# EAGLE design BTsoundCard Proto R1 (EAGLE 9.6.2)
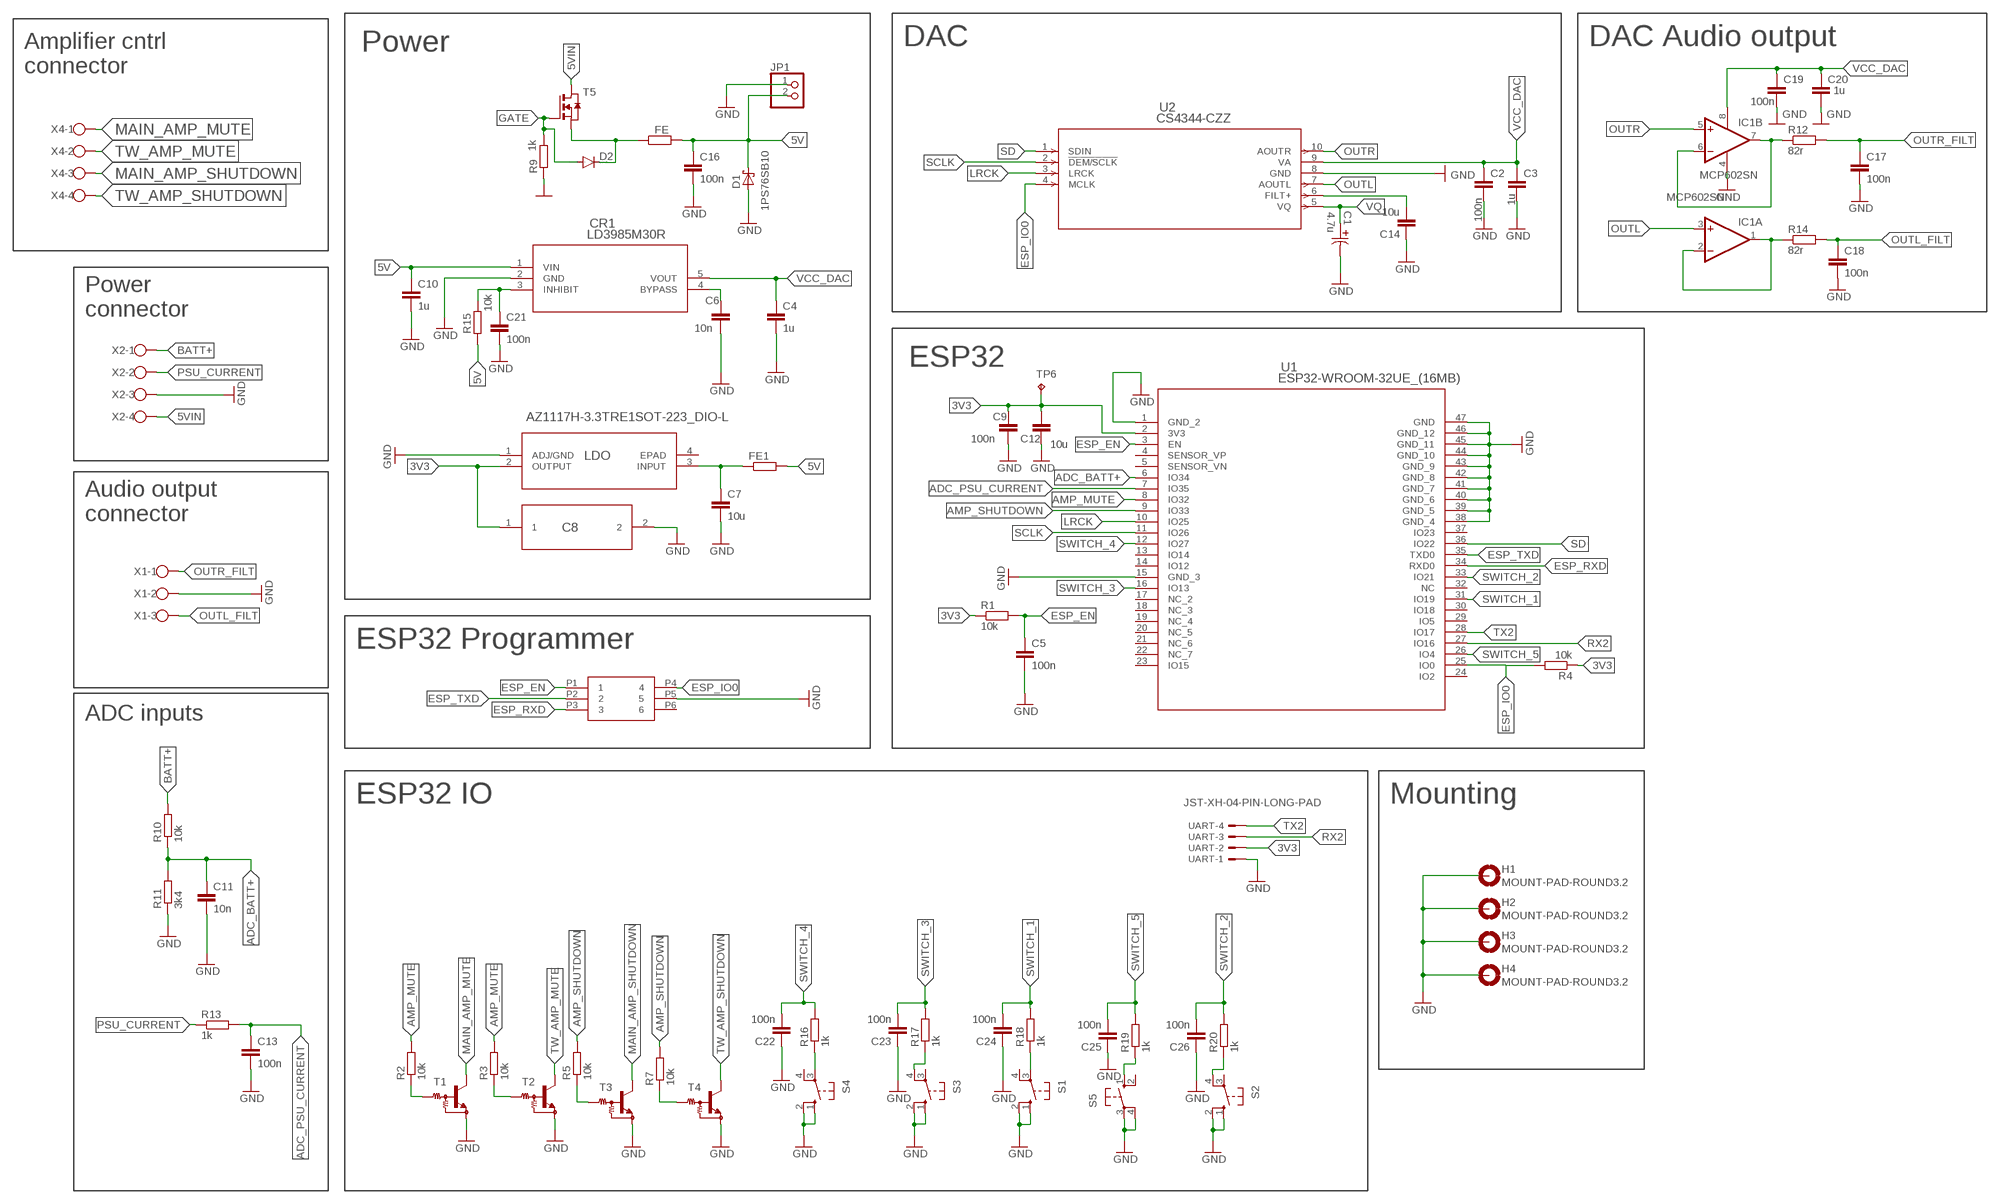
[diagram p0: schematic, sheet 1]

## Parts
C1  4.7u  EEEFK1H4R7RCAP_EEFK_B_PAN-M  [CAP_EEFK_B_PAN-M]
C2  100n  C-EUC0603  [C0603]
C3  1u  C-EUC0603  [C0603]
C4  1u  C-EUC0603  [C0603]
C5  100n  C-EUC0603  [C0603]
C6  10n  C-EUC0603  [C0603]
C7  10u  C-EUC0805  [C0805]
C8  TPSC336K010R0375  [TPSC336K010R0375_AVX]
C9  100n  C-EUC0603  [C0603]
C10  1u  C-EUC0603  [C0603]
C11  10n  C-EUC0603  [C0603]
C12  10u  C-EUC0805  [C0805]
C13  100n  C-EUC0603  [C0603]
C14  10u  C-EUC0805  [C0805]
C16  100n  C-EUC0603  [C0603]
C17  100n  C-EUC0603  [C0603]
C18  100n  C-EUC0603  [C0603]
C19  100n  C-EUC0603  [C0603]
C20  1u  C-EUC0603  [C0603]
C21  100n  C-EUC0603  [C0603]
C22  100n  C-EUC0603  [C0603]
C23  100n  C-EUC0603  [C0603]
C24  100n  C-EUC0603  [C0603]
C25  100n  C-EUC0603  [C0603]
C26  100n  C-EUC0603  [C0603]
CR1  LD3985M30R  [SOT23-5L_STM]
D1  1PS76SB10  [SOD323(F)]
D2  5.1V  DIODE-MINIMELF  [MINIMELF]
FE  R-EU_R0805  [R0805]
FE1  R-EU_R0805  [R0805]
H1  MOUNT-PAD-ROUND3.2  [3,2-PAD]
H2  MOUNT-PAD-ROUND3.2  [3,2-PAD]
H3  MOUNT-PAD-ROUND3.2  [3,2-PAD]
H4  MOUNT-PAD-ROUND3.2  [3,2-PAD]
IC1  MCP602SN  [SO08]
JP1  PINHD-1X2  [1X02]
LDO  AZ1117H-3.3TRE1SOT-223_DIO-L  [SOT-223_DIO-L]
R1  10k  R-EU_R0603  [R0603]
R2  10k  R-EU_R0603  [R0603]
R3  10k  R-EU_R0603  [R0603]
R4  10k  R-EU_R0603  [R0603]
R5  10k  R-EU_R0603  [R0603]
R7  10k  R-EU_R0603  [R0603]
R9  1k  R-EU_R1206  [R1206]
R10  10k  R-EU_R0805  [R0805]
R11  3k4  R-EU_R0603  [R0603]
R12  82r  R-EU_R1206  [R1206]
R13  1k  R-EU_R0603  [R0603]
R14  82r  R-EU_R1206  [R1206]
R15  10k  R-EU_R0603  [R0603]
R16  1k  R-EU_R0603  [R0603]
R17  1k  R-EU_R0603  [R0603]
R18  1k  R-EU_R0603  [R0603]
R19  1k  R-EU_R0603  [R0603]
R20  1k  R-EU_R0603  [R0603]
S1  10-XX  [B3F-10XX]
S2  10-XX  [B3F-10XX]
S3  10-XX  [B3F-10XX]
S4  10-XX  [B3F-10XX]
S5  10-XX  [B3F-10XX]
T1  MUN2212T1-NPN_DRIVER-SC59-BEC  [SC59-BEC]
T2  MUN2212T1-NPN_DRIVER-SC59-BEC  [SC59-BEC]
T3  MUN2212T1-NPN_DRIVER-SC59-BEC  [SC59-BEC]
T4  MUN2212T1-NPN_DRIVER-SC59-BEC  [SC59-BEC]
T5  NMOSSOT23  [SOT-23]
TP6  TPPAD1-13  [P1-13]
U1  ESP32-WROOM-32UE_(16MB)  [IC38_ESP32-WROOM-32UE_(16MB)_E]
U2  CS4344-CZZ  [CIR-TSSOP-10]
U$3  3X2  [2X3]
UART  JST-XH-04-PIN-LONG-PAD  [JST-XH-04-PACKAGE-LONG-PAD]
X1  W237-103  [W237-103]
X2  W237-4  [W237-4]
X4  W237-4  [W237-4]

## Nets
3V3: C8.1 C9.1 C12.2 LDO.2(OUTPUT) R1.1 R4.1 TP6.TP U1.2(3V3) UART.2
5V: C10.1 C16.1 CR1.1(VIN) D1.1(K) FE1.2 FE.2 JP1.2 R15.1
5VIN: T5.1(D) X2.4
ADC_BATT+: C11.1 R10.1 R11.2 U1.6(IO34)
ADC_PSU_CURRENT: C13.1 R13.2 U1.7(IO35)
AMP_MUTE: R2.2 R3.2 U1.8(IO32)
AMP_SHUTDOWN: R5.2 R7.2 U1.9(IO33)
BATT+: R10.2 X2.1
ESP_EN: C5.1 R1.2 U1.3(EN) U$3.P1
ESP_IO0: R4.2 U1.25(IO0) U2.4(MCLK) U$3.P4
ESP_RXD: U1.34(RXD0) U$3.P3
ESP_TXD: U1.35(TXD0) U$3.P2
GATE: D2.A R9.2 T5.3(G)
GND: C1.2 C2.2 C3.2 C4.2 C5.2 C6.2 C7.2 C8.2 C9.2 C10.2 C11.2 C12.1 C13.2 C14.1 C16.2 C17.2 C18.2 C19.2 C20.2 C21.2 C22.1 C23.1 C24.1 C25.1 C26.1 CR1.2(GND) D1.2(A) H1.B3,2(MOUNT) H2.B3,2(MOUNT) H3.B3,2(MOUNT) H4.B3,2(MOUNT) IC1.4(P:V-) JP1.1 LDO.1(ADJ/GND) R9.1 R11.1 S1.1(S) S1.2(S1) S2.1(S) S2.2(S1) S3.1(S) S3.2(S1) S4.1(S) S4.2(S1) S5.3(P) S5.4(P1) T1.E T2.E T3.E T4.E U1.1(GND_2) U1.15(GND_3) U1.38(GND_4) U1.39(GND_5) U1.40(GND_6) U1.41(GND_7) U1.42(GND_8) U1.43(GND_9) U1.44(GND_10) U1.45(GND_11) U1.46(GND_12) U1.47(GND) U2.8(GND) U$3.P5 UART.1 X1.2 X2.3
LRCK: U1.10(IO25) U2.3(LRCK)
MAIN_AMP_MUTE: T1.C X4.1
MAIN_AMP_SHUTDOWN: T3.C X4.3
N$2: IC1.6(B:-IN) IC1.7(B:OUT) R12.1
N$4: R16.1 S4.3(P)
N$5: C6.1 CR1.4(BYPASS)
N$6: R17.1 S3.4(P1)
N$7: C14.2 U2.6(FILT+)
N$8: C7.1 FE1.1 LDO.3(INPUT)
N$9: R2.1 T1.B
N$10: R3.1 T2.B
N$11: R5.1 T3.B
N$12: R7.1 T4.B
N$13: R18.1 S1.3(P)
N$14: C21.1 CR1.3(INHIBIT) R15.2
N$15: R19.1 S5.1(S)
N$16: R20.1 S2.4(P1)
N$17: D2.C FE.1 T5.2(S)
N$20: IC1.1(A:OUT) IC1.2(A:-IN) R14.1
OUTL: IC1.3(A:+IN) U2.7(AOUTL)
OUTL_FILT: C18.1 R14.2 X1.3
OUTR: IC1.5(B:+IN) U2.10(AOUTR)
OUTR_FILT: C17.1 R12.2 X1.1
PSU_CURRENT: R13.1 X2.2
RX2: U1.27(IO16) UART.3
SCLK: U1.11(IO26) U2.2(!DEM/SCLK)
SD: U1.36(IO22) U2.1(SDIN)
SWITCH_1: C24.2 R18.2 U1.31(IO19)
SWITCH_2: C26.2 R20.2 U1.33(IO21)
SWITCH_3: C23.2 R17.2 U1.16(IO13)
SWITCH_4: C22.2 R16.2 U1.12(IO27)
SWITCH_5: C25.2 R19.2 U1.26(IO4)
TW_AMP_MUTE: T2.C X4.2
TW_AMP_SHUTDOWN: T4.C X4.4
TX2: U1.28(IO17) UART.4
VCC_DAC: C2.1 C3.1 C4.1 C19.1 C20.1 CR1.5(VOUT) IC1.8(P:V+) U2.9(VA)
VQ: C1.1 U2.5(VQ)
Unconnected: LDO.4(EPAD) S1.4(P1) S2.3(P) S3.3(P) S4.4(P1) S5.2(S1) U1.4(SENSOR_VP) U1.5(SENSOR_VN) U1.13(IO14) U1.14(IO12) U1.17(NC_2) U1.18(NC_3) U1.19(NC_4) U1.20(NC_5) U1.21(NC_6) U1.22(NC_7) U1.23(IO15) U1.24(IO2) U1.29(IO5) U1.30(IO18) U1.32(NC) U1.37(IO23) U$3.P6

## Notes on the sheet
- Power | DAC | DAC Audio output
- Amplifier cntrl
  connector
- Power
  connector
- ESP32
- Audio output
  connector
- ESP32 Programmer
- ADC inputs
- ESP32 IO | Mounting

## Library data of the parts
C1 = Panasonic EEEFK1H4R7R:EEEFK1H4R7R; BUILT_BY: EMA_UL_Team; MANUFACTURER_PART_NUMBER: EEEFK1H4R7R; SOURCELIBRARY: Panasonic_2012-04-02a; VENDOR: Panasonic
C2-C7 C9-C14 C16-C26 = rcl:C-EU: CAPACITOR, European symbol; SPICEPREFIX: C
C8 = TPSC336K010R0375:TPSC336K010R0375; BUILT_BY: EMA_Colton; COPYRIGHT: Copyright (C) 2018 Accelerated Designs. All rights reserved; DATASHEET: https://datasheets.avx.com/TPS.pdf; MANUFACTURER_PART_NUMBER: TPSC336K010R0375; SOURCELIBRARY: Add_to_database_2021-03-22; VENDOR: AVX Corporation
CR1 = LD3985:LD3985M30R; COPYRIGHT: Copyright (C) 2023 Ultra Librarian. All rights reserved.; MANUFACTURER_PART_NUMBER: LD3985M30R; MFR_NAME: STMicroelectronics
D1 = SOD-123:1PS76SB10: Schottky barrier diode Planar Schottky barrier diode encapsulated in a SOD323 very small plastic SMD package. AAL Eindhoven MK
D2 = diode:DIODE-: DIODE
FE FE1 R1-R5 R7 R9-R20 = rcl:R-EU_: RESISTOR, European symbol; SPICEPREFIX: R
H1-H4 = holes:MOUNT-PAD-ROUND: MOUNTING PAD, round
IC1 = linear:MCP602: Single Op Amp 2.7V to 6.0V Single Supply CMOS Source: http://ww1.microchip.com/downloads/en/DeviceDoc/21314g.pdf
JP1 = pinhead:PINHD-1X2: PIN HEADER
LDO = sot223 3.3v 1A:AZ1117H-3.3TRE1; BUILT_BY: EMA_UL_Team; MANUFACTURER_PART_NUMBER: AZ1117H-3.3TRE1; SOURCELIBRARY: DIODESINC_2_2015-08-18; VENDOR: Diodes Inc
S1-S5 = switch-omron:10-XX: OMRON SWITCH; MPN: B3F-1000; OC_FARNELL: 176432; OC_NEWARK: 36M3542
T1-T4 = transistor:*-NPN_DRIVER-: NPN Bias Resistor Transistor
T5 = zetex:NMOSSOT23: MOS FET; OC_FARNELL: unknown; OC_NEWARK: unknown
TP6 = testpad:TP: Test pad
U1 = ESP32-WROOM-32:ESP32-WROOM-32UE_(16MB); COPYRIGHT: Copyright (C) 2022 Ultra Librarian. All rights reserved.; MANUFACTURER_PART_NUMBER: ESP32-WROOM-32UE (16MB); MFR_NAME: Espressif Systems
U2 = user:CS4344-CZZ; COPYRIGHT: Copyright (C) 2023 Ultra Librarian. All rights reserved.; MANUFACTURER_PART_NUMBER: CS4344-CZZ; MFR_NAME: Cirrus Logic
U$3 = IDC_3x2:3X2
UART = JST XH Connectors v1-0:JST-XH-04-PIN: JST XH Connector 2 Pin Wire to board connector. Pitch: 2,54 mm, (0.100") Number of pins: 4 Created by Rembrandt Electronics www.rembrandtelectronics.com
X1 = con-wago-500:W237-103: WAGO SCREW CLAMP; MPN: 237-103; OC_FARNELL: unknown; OC_NEWARK: 18M7116
X2 X4 = con-wago-500:W237-4: WAGO SCREW CLAMP; OC_FARNELL: unknown; OC_NEWARK: unknown

## Board
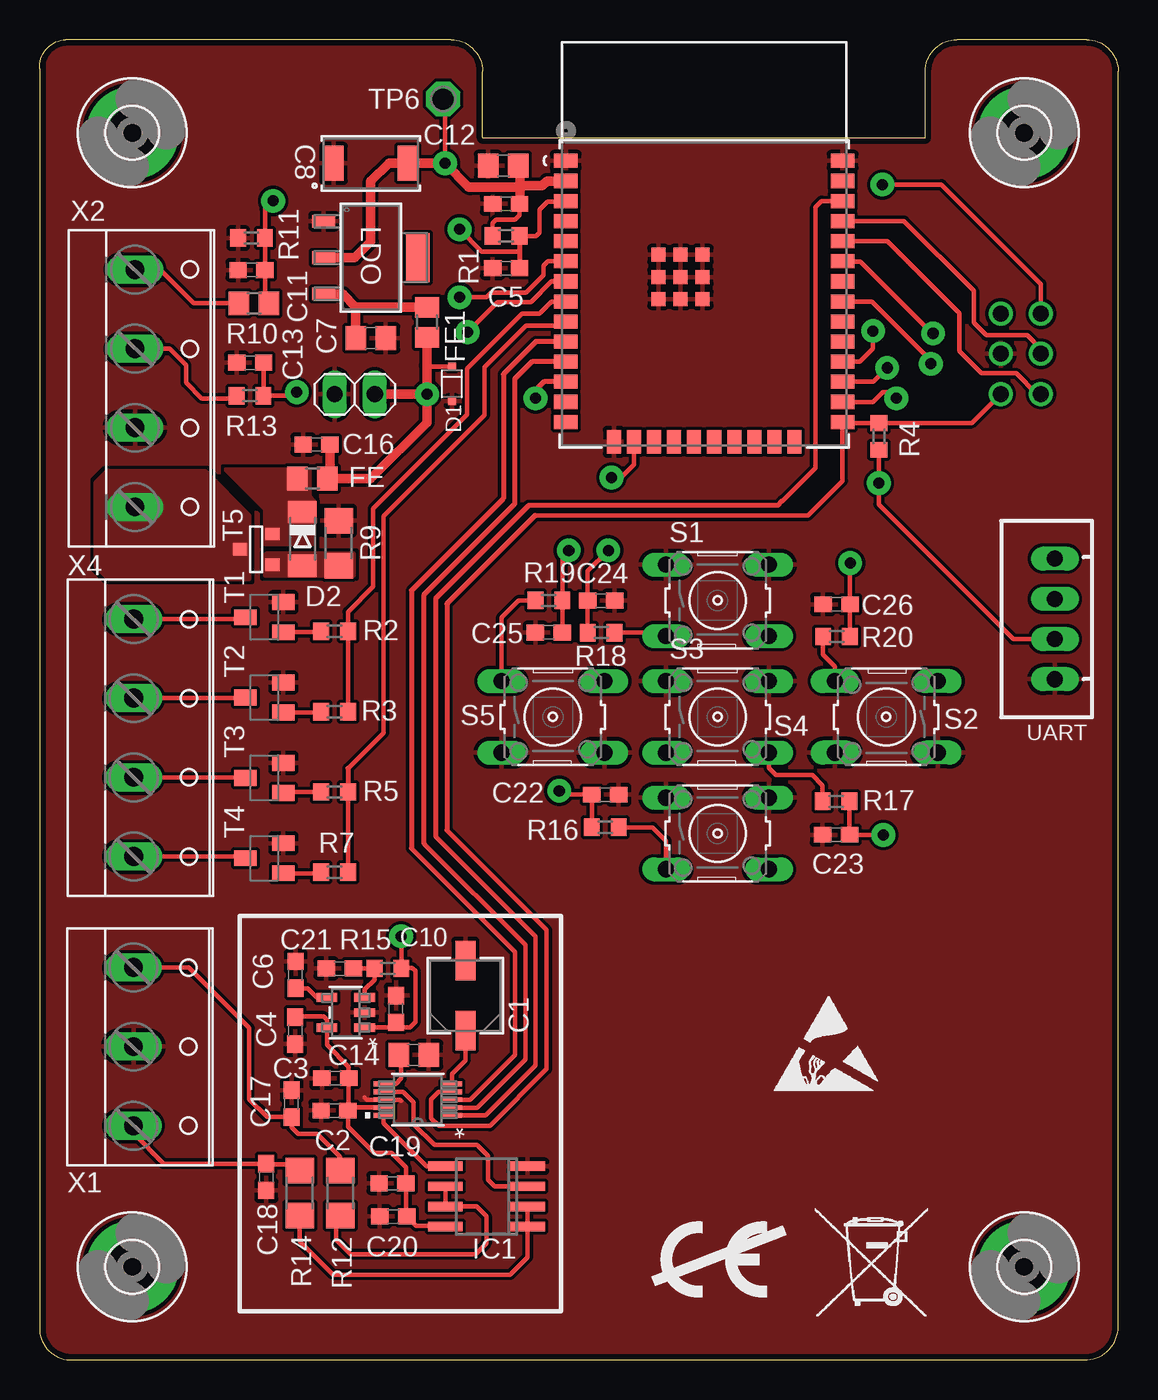
[diagram p1: board, top side]
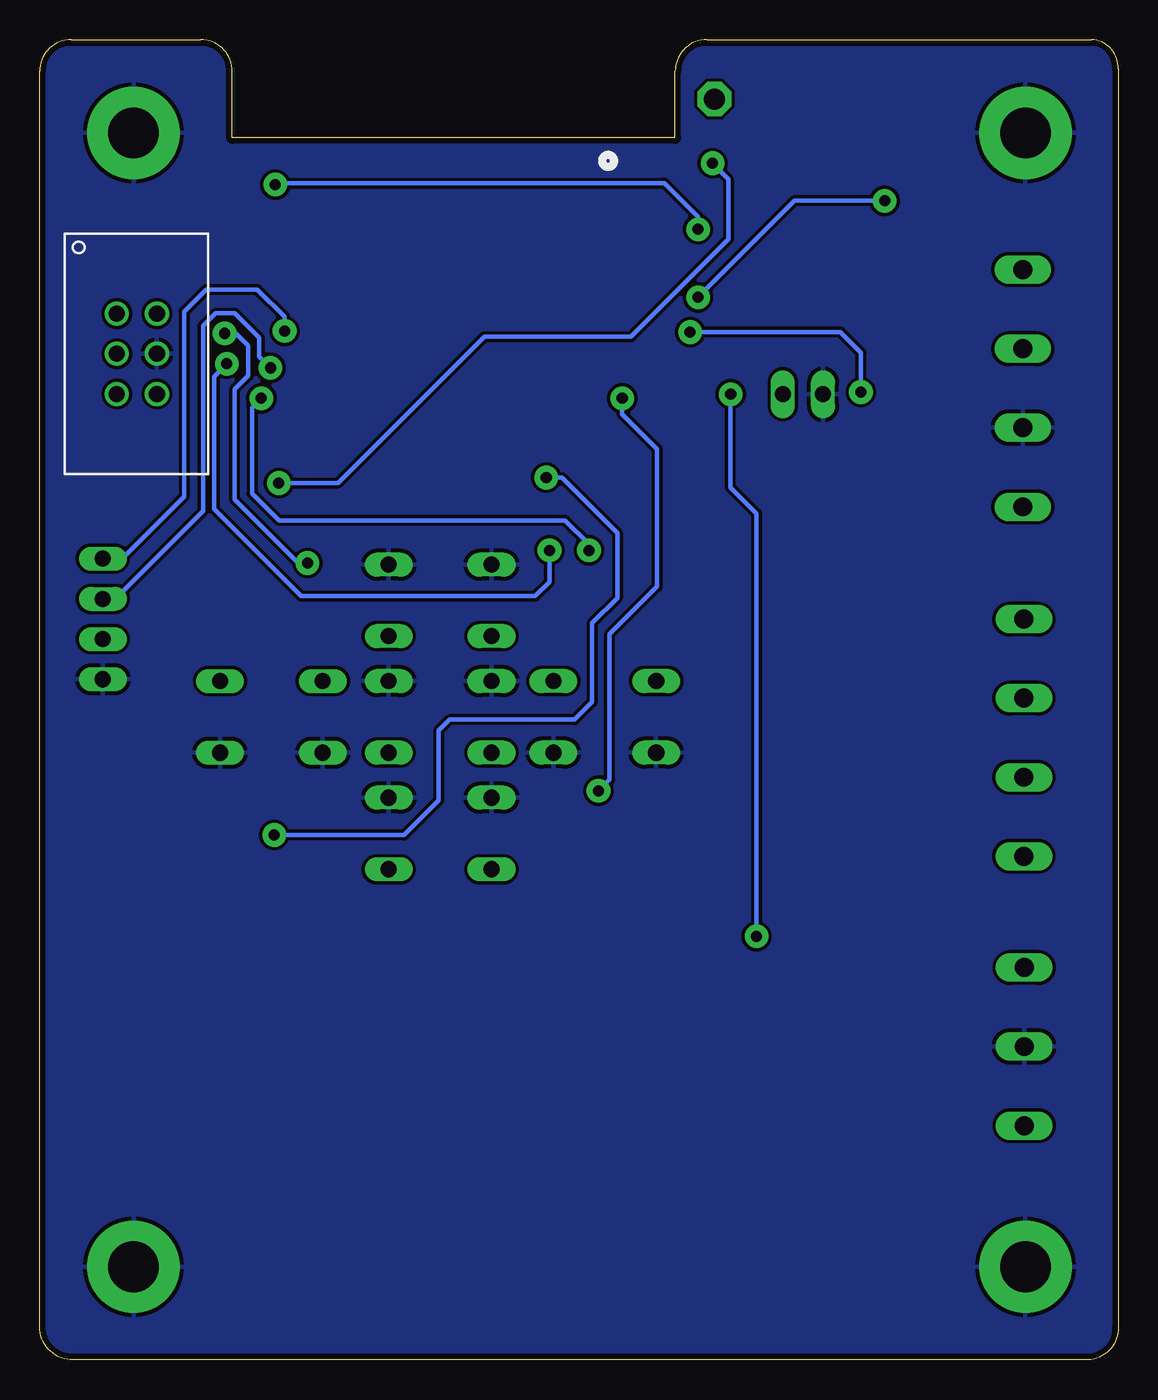
[diagram p2: board, bottom side, seen from below]

Size 68.21 x 83.49 mm. Coordinates in mm from the lower left corner, seen from the top.
Outline: 28.01,77.28 28.01,81.48 arc90 26.01,83.48 1.66,83.49 arc90 0,81.64 0,2.06 arc90 1.9,0.01 65.86,0.01 arc90 68.21,1.91 68.21,81.48 arc90 66.21,83.48 58.01,83.48 arc90 56.01,81.48 56.01,77.28 28.01,77.28
Copper layers (1*16): Top 0.035mm / dielectric 1.5mm / Bottom 0.035mm
Design rules "default *": minimum track width 0.2mm, minimum drill 0.7mm, track to track 8mil, track to pad 8mil, pad to pad 8mil, via to via 8mil, smd to smd 8mil, copper to edge 15mil, drill to drill 6mil, minimum pad ring 10mil, minimum via ring 8mil, stop-mask expansion 4mil, vias tented up to drill 0mil, thermal gap 10mil

### Footprints (pad centres in the part's own frame; a part is rotated, then mirrored left to right if it is on the bottom)
CAP_EEFK_B_PAN-M = smd 2.515 x 1.27: 1 -2.21,0; 2 2.21,0
C0603 = smd 1.1 x 1: 1 -0.85,0; 2 0.85,0
C0805 = smd 1.3 x 1.5: 1 -0.95,0; 2 0.95,0
TPSC336K010R0375_AVX = smd 1.295 x 2.21: 1 -2.352,0; 2 2.352,0
SOT23-5L_STM = smd 1.321 x 0.559: 1 -1.194,0.95; 2 -1.194,0; 3 -1.194,-0.95; 4 1.194,-0.95; 5 1.194,0.95
SOD323(F) = smd 0.5 x 0.5: 1 1.1,0; 2 -1.1,0
MINIMELF = smd 1.4 x 1.8: A 1.7,0; C -1.7,0
R0805 = smd 1.3 x 1.5: 1 -0.95,0; 2 0.95,0
3,2-PAD = drill 3.2 pad 5.842: B3,2 0,0
SO08 = smd 0.6 x 2.2: 1 -1.905,-2.6; 2 -0.635,-2.6; 3 0.635,-2.6; 4 1.905,-2.6; 5 1.905,2.6; 6 0.635,2.6; 7 -0.635,2.6; 8 -1.905,2.6
1X02 = drill 1.016 long: 1 -1.27,0; 2 1.27,0
SOT-223_DIO-L = smd 0.8 x 1.456: 1 -2.3,-2.974; 2 0,-2.974; 3 2.3,-2.974 | smd 3.1 x 1.456: 4 0,2.974
R0603 = smd 1 x 1.1: 1 -0.85,0; 2 0.85,0
R1206 = smd 1.6 x 1.803: 1 -1.422,0; 2 1.422,0
B3F-10XX = drill 1.016 long: 1 -3.251,2.261; 2 3.251,2.261; 3 -3.251,-2.261; 4 3.251,-2.261
SC59-BEC = smd 1 x 1.4: B -0.95,-1.2; C 0,1.2; E 0.95,-1.2
SOT-23 = smd 0.787 x 0.889: 1 0.025,-1.016; 2 -0.94,1.016; 3 0.991,1.016
P1-13 = drill 1.321 pad 2.159 octagon: TP 0,0
IC38_ESP32-WROOM-32UE_(16MB)_E = smd 1.499 x 0.889: 1 -8.75,8.409; 2 -8.75,7.139; 3 -8.75,5.869; 4 -8.75,4.599; 5 -8.75,3.329; 6 -8.75,2.059; 7 -8.75,0.789; 8 -8.75,-0.481; 9 -8.75,-1.751; 10 -8.75,-3.021; 11 -8.75,-4.291; 12 -8.75,-5.561; 13 -8.75,-6.831; 14 -8.75,-8.101; 25 8.75,-8.101; 26 8.75,-6.831; 27 8.75,-5.561; 28 8.75,-4.291; 29 8.75,-3.021; 30 8.75,-1.751; 31 8.75,-0.481; 32 8.75,0.789; 33 8.75,2.059; 34 8.75,3.329; 35 8.75,4.599; 36 8.75,5.869; 37 8.75,7.139; 38 8.75,8.409 | smd 0.889 x 1.499: 15 -5.715,-9.352; 16 -4.445,-9.352; 17 -3.175,-9.352; 18 -1.905,-9.352; 19 -0.635,-9.352; 20 0.635,-9.352; 21 1.905,-9.352; 22 3.175,-9.352; 23 4.445,-9.352; 24 5.715,-9.352 | smd 0.889 x 0.889: 39 -2.904,2.469; 40 -1.504,2.469; 41 -0.104,2.469; 42 -2.904,1.069; 43 -1.504,1.069; 44 -0.104,1.069; 45 -2.904,-0.331; 46 -1.504,-0.331; 47 -0.104,-0.331
CIR-TSSOP-10 = smd 1.308 x 0.305: 1 -2.153,1; 2 -2.153,0.5; 3 -2.153,0; 4 -2.153,-0.5; 5 -2.153,-1; 6 2.153,-1; 7 2.153,-0.5; 8 2.153,0; 9 2.153,0.5; 10 2.153,1
2X3 = drill 1.016: P1 0,0; P2 2.54,0; P3 5.08,0; P4 5.08,2.54; P5 2.54,2.54; P6 0,2.54
JST-XH-04-PACKAGE-LONG-PAD = drill 1.016 long: 1 -3.81,0; 2 -1.27,0; 3 1.27,0; 4 3.81,0
W237-103 = drill 1.194 long: 1 -5,-1.29; 2 0,-1.29; 3 5,-1.29
W237-4 = drill 1.194 long: 1 -7.5,-1.27; 2 -2.5,-1.27; 3 2.5,-1.27; 4 7.5,-1.27

### Placement (x,y rotation side)
C1  26.93,23.04 90 top
C2  18.65,15.77 180 top
C3  18.7,17.82 180 top
C4  16.16,20.82 270 top
C5  29.5,69.04 180 top
C6  16.19,24.35 90 top
C7  20.95,64.62 0 top
C8  20.95,75.67 180 top
C9  29.5,73.1 180 top
C10  22.54,22.19 90 top
C11  13.41,68.92 180 top
C12  29.32,75.51 0 top
C13  13.32,63.05 180 top
C14  23.66,19.29 180 top
C16  17.52,57.89 180 top
C17  15.94,16.21 90 top
C18  14.34,11.57 270 top
C19  22.32,11.18 180 top
C20  22.37,9.08 180 top
C21  18.98,24.76 180 top
C22  35.77,35.75 180 top
C23  50.37,33.21 0 top
C24  35.51,48.02 180 top
C25  32.21,45.99 0 top
C26  50.4,47.78 0 top
CR1  19.36,21.97 180 top
D1  26.07,61.72 90 top
D2  16.63,51.92 270 top
FE  17.26,55.73 0 top
FE1  24.5,65.61 270 top
H1  5.86,5.89 0 top
H2  62.26,77.59 0 top
H3  62.26,5.89 0 top
H4  5.86,77.59 0 top
IC1  28.26,10.34 90 top
JP1  19.93,61.06 0 top
LDO  20.95,69.7 270 top
R1  29.5,71.07 0 top
R2  18.66,46.08 0 top
R3  18.66,41 0 top
R4  53.08,58.39 90 top
R5  18.66,35.92 0 top
R7  18.66,30.84 0 top
R9  18.91,51.64 270 top
R10  13.56,66.81 180 top
R11  13.4,70.94 0 top
R12  19.02,10.56 90 top
R13  13.31,60.97 0 top
R14  16.45,10.56 90 top
R15  22.03,24.76 180 top
R16  35.77,33.69 180 top
R17  50.37,35.32 0 top
R18  35.51,45.99 180 top
R19  32.21,48.02 0 top
R20  50.4,45.75 0 top
S1  42.88,48.02 0 top
S2  53.54,40.66 180 top
S3  42.88,40.66 0 top
S4  42.88,33.29 0 top
S5  32.46,40.66 0 top
T1  14.22,46.96 90 top
T2  14.22,41.88 90 top
T3  14.22,36.8 90 top
T4  14.22,31.72 90 top
T5  13.71,51.28 270 top
TP6  25.52,79.73 90 top
U1  42.03,67.41 0 top
U2  23.92,16.46 180 top
U$3  63.32,66.16 270 bottom
UART  64.21,46.85 90 top
X1  7.23,19.81 270 top
X2  7.3,61.44 270 top
X4  7.23,39.34 270 top

### Tracks (layer width: path | path; a pad name or v marks a point on that pad's centre or on a via)
3V3  (via drill 0.7 pad 1.5)
  Top 0.3: R4.1 v53.08,55.45 v53.07,55.45 53.07,54.1 53.06,54.09 61.57,45.58 UART.2 | C9.1 30.35,72.38 30.06,72.09 28.86,72.09 28.65,71.88 R1.1 | TP6.TP 25.65,79.6 v25.65,75.67
  Top 0.6: 27.34,74.17 27.14,74.17 v25.65,75.67 C8.1
  Top 0.61: U1.2 32.08,74.55 31.78,74.25 30.39,74.25 | C12.2 30.39,75.4 30.39,74.25 | 30.39,74.25 30.39,74.17 | 30.39,74.17 30.39,73.14 C9.1 | LDO.2 19.93,69.7 20.95,70.71 20.95,74.52 22.09,75.67 C8.1 | 30.39,74.17 27.34,74.17 | v25.64,75.67 v25.65,75.67
  Bottom 0.3: v25.65,75.67 24.65,74.67 24.65,70.87 30.81,64.7 40.07,64.7 49.32,55.45 v53.07,55.45
5V  (via drill 0.7 pad 1.5)
  Top 0.3: CR1.1 22.21,21.02 C10.1 22.84,21.04 23.42,21.04 23.76,21.39 23.76,24.59 23.56,24.79 22.91,24.79 R15.1 22.88,26.79 v22.86,26.79 | D1.1 24.57,62.82 24.5,62.89
  Top 0.6: FE1.2 24.5,62.89 24.5,61.57
  Top 0.61: 24.5,60.55 24.5,59.28 20.95,55.73 FE.2 18.37,55.88 C16.1 | 24.5,60.55 v24.5,61.06 | v24.5,61.06 24.5,61.57 23.99,61.06 | JP1.2 23.99,61.06 | v24.5,61.06 23.99,61.06 | 23.99,61.06 24.5,60.55
  Bottom 0.3: v24.5,61.06 24.5,55.16 22.86,53.52 v22.86,26.79
5VIN
  pour Top (no thermals): 4.26,56.19 10.46,56.19 13.26,53.39 13.26,49.39 4.36,49.39 3.56,50.19 3.56,55.49
ADC_BATT+  (via drill 0.7 pad 1.5)
  Top 0.3: U1.6 32.14,69.47 31.86,69.19 31.86,68.59 30.76,67.49 28.56,67.49 28.26,67.19 v26.56,67.19 | R10.1 14.26,67.06 C11.1 R11.2 14.25,72.78 v14.76,73.29
  Bottom 0.3: v14.76,73.29 20.46,73.29 v26.56,67.19
ADC_PSU_CURRENT  (via drill 0.7 pad 1.5)
  Top 0.3: 32.5,68.2 32.37,68.2 31.06,66.89 28.96,66.89 v27.06,64.99 | C13.1 14.16,63.04 R13.2 16.04,60.97 v16.26,61.19
  Top 0.305: U1.7 32.5,68.2
  Bottom 0.3: v16.26,61.19 16.26,63.69 17.56,64.99 v27.06,64.99
AMP_MUTE
  Top 0.3: U1.8 32.36,66.93 31.6,66.17 30.52,66.17 27.04,62.69 27.04,59.79 21.1,53.85 21.1,48.9 19.51,47.31 R2.2 R3.2
AMP_SHUTDOWN
  Top 0.3: U1.9 33.02,65.41 30.77,65.41 28.15,62.79 28.15,59.75 21.76,53.36 21.76,39.65 19.51,37.4 | R5.2 R7.2
  Top 0.305: 19.51,37.4 R5.2
BATT+
  Top 0.3: X2.1 7.61,68.94 9.75,66.81 R10.2
ESP_EN  (via drill 0.7 pad 1.5)
  Top 0.3: 33.25,73.25 32.12,73.25 31.61,72.75 31.61,71.28 31.41,71.07 R1.2 | 30.35,70.09 27.96,70.09 v26.56,71.49 | U$3.P1 63.32,68.03 57.03,74.32 v53.3,74.32
  Top 0.305: U1.3 33.25,73.25 | R1.2 30.35,70.09 C5.1
  Bottom 0.3: v26.56,71.49 26.56,72.29 28.7,74.42 53.2,74.42 v53.3,74.32
ESP_IO0
  Top 0.3: 50.84,59.24 R4.2 58.95,59.24 U$3.P4 | U1.25 50.78,55.59 48.59,53.4 31.35,53.4 | 25.76,33.49 32.06,27.19 32.06,18.39 28.47,14.8 25.25,14.8 24.76,15.29 24.76,16.49 25.23,16.95 U2.4
  Top 0.305: 31.35,53.4 25.76,47.82 25.76,33.49
  Top 0.406: U1.25 50.84,59.24
ESP_RXD
  Top 0.3: U1.34 53.6,70.74 58.16,66.18 58.16,63.79 59.56,62.39 61.76,62.39 63.08,61.08 U$3.P3
ESP_TXD
  Top 0.3: U1.35 54.66,72.01 59.07,67.6 59.07,65.6 59.06,65.59 59.86,64.79 62.46,64.79 63.32,63.93 U$3.P2
GATE
  Top 0.61: 14.8,50.22 T5.3
  pour Top (no thermals): 14.36,50.99 19.86,50.99 19.86,49.59 14.26,49.59 14.26,50.89
GND
  Top 0.3: 20.56,16.59 20.7,16.46 U2.8 22.8,16.46 22.86,16.39
  pour Top (rank 2): -1.66,87.22 70.48,87.22 70.48,-3.71 -1.66,-3.71
  pour Bottom: -3.04,87.29 69.86,87.29 69.86,-2.61 -3.04,-2.61 -3.04,87.19
LRCK
  Top 0.3: U2.3 27.23,16.46 30.06,19.29 30.06,25.79 23.51,32.35
  Top 0.305: U1.10 31.39,64.39 29.33,62.33 29.33,54.48 23.51,48.66 23.51,32.35
MAIN_AMP_MUTE
  Top 0.3: X4.1 12.9,46.84
  Top 0.406: 12.9,46.84 T1.C
MAIN_AMP_SHUTDOWN
  Top 0.3: X4.3 12.98,36.84
  Top 0.406: 12.98,36.84 T3.C
N$2
  Top 0.3: IC1.6 IC1.7 27.65,9.71 28.26,9.09 28.26,7.39 27.56,6.69 19.66,6.69 18.76,7.59 18.76,8.88 R12.1
N$4
  Top 0.3: R16.1 38.77,33.69 39.63,32.83 S4.3
N$5
  Top 0.3: CR1.4 17.52,22.92 16.94,23.5 C6.1
N$6
  Top 0.3: R17.1 49.52,36.34 48.86,36.99 46.56,36.99 46.13,37.43 S3.4
N$7
  Top 0.3: U2.6 22.53,17.46 22.86,17.79 22.86,19.14 C14.2
N$8
  Top 0.61: LDO.3 19.18,67.4 20,66.58 | C7.1 20,66.58 | 20,66.58 24.48,66.58 FE1.1
N$9
  Top 0.3: T1.B 17.75,46.01 R2.1
N$10
  Top 0.3: T2.B 17.75,40.93 R3.1
N$11
  Top 0.3: 15.48,35.92 R5.1
  Top 0.305: 15.48,35.92 T3.B
N$12
  Top 0.3: T4.B 17.75,30.77 R7.1
N$13
  Top 0.3: R18.1 39.4,45.99 S1.3
N$14
  Top 0.3: CR1.3 20.56,23.42 21.18,24.05 R15.2 C21.1
N$15
  Top 0.3: R19.1 30.3,48.02 29.21,46.94 S5.1
N$16
  Top 0.3: S2.4 50.29,43.86 49.55,44.61 R20.1
N$17
  Top 0.61: T5.2 14.8,52.3 | D2.C 16.31,53.93
  pour Top (no thermals): 14.26,51.59 17.36,51.59 17.36,54.29 17.06,54.59 17.06,56.29 11.76,56.29 14.26,53.79
N$20
  Top 0.3: IC1.2 IC1.1 30.86,6.49 29.76,5.39 18.56,5.39 16.45,7.5 R14.1
OUTL
  Top 0.3: U2.7 23,16.96 23.66,16.29 23.66,14.89 24.96,13.59 27.66,13.59 28.36,12.89 28.36,11.39 28.78,10.98 IC1.3
OUTL_FILT
  Top 0.3: R14.2 16.05,12.38 14.38,12.38 C18.1 7.84,12.41 5.94,14.31 X1.3
OUTR
  Top 0.3: IC1.5 24.48,12.25 21.77,14.96 U2.10
OUTR_FILT
  Top 0.3: R12.2 19.02,12.84 17.56,14.29 16.36,14.29 15.94,14.72 C17.1 14.4,15.36 13.26,16.49 13.26,20.99 9.44,24.81 X1.1
PSU_CURRENT
  Top 0.3: R13.1 12.28,60.79 10.26,60.79 9.26,61.79 9.26,62.89 8.21,63.94 X2.2
RX2  (via drill 0.7 pad 1.5)
  Top 0.3: U1.27 52.72,61.85 v53.6,62.73
  Bottom 0.3: UART.3 63.43,48.12 57.86,53.69 57.86,65.39 57.06,66.19 55.86,66.19 54.3,64.63 54.3,63.43 v53.6,62.73
SCLK
  Top 0.3: U2.2 27.67,15.95 30.72,19 30.72,26.24 24.32,32.64
  Top 0.305: U1.11 31.13,63.12 30.04,62.02 30.04,54.13 24.32,48.41 24.32,32.64
SD
  Top 0.3: 25.04,33.11 31.36,26.79 31.36,18.61 28.22,15.46 U2.1 | 46.98,54.33 47,54.33 49.06,56.39 49.06,72.89 49.45,73.28 U1.36
  Top 0.305: 25.04,33.11 25.04,48.14 30.93,54.03 46.68,54.03 46.98,54.33
SWITCH_1  (via drill 0.7 pad 1.5)
  Top 0.3: R18.2 C24.2 34.66,49.89 v35.96,51.19 | v56.36,62.99 56.36,63.19 52.63,66.93 U1.31
  Bottom 0.3: v56.36,62.99 57.16,62.19 57.16,53.79 51.66,48.29 36.86,48.29 35.96,49.19 v35.96,51.19
SWITCH_2  (via drill 0.7 pad 1.5)
  Top 0.3: U1.33 51.54,69.47 51.56,69.46 51.91,69.46 56.45,64.91 v56.5,64.91 | R20.2 C26.2 51.25,50.37 v51.26,50.39
  Bottom 0.3: v51.26,50.39 51.86,50.39 55.86,54.39 55.86,61.38 55.01,62.24 55.01,64.15 55.77,64.91 v56.5,64.91
SWITCH_3  (via drill 0.7 pad 1.5)
  Top 0.3: R17.2 C23.2 51.23,33.19 v53.36,33.19 | U1.16 37.58,56.61 36.76,55.79 v36.16,55.79
  Bottom 0.3: v36.16,55.79 35.16,55.79 31.66,52.29 31.66,48.19 33.26,46.59 33.26,41.59 34.36,40.49 42.26,40.49 42.96,39.79 42.96,35.39 45.16,33.19 v53.36,33.19
SWITCH_4  (via drill 0.7 pad 1.5)
  Top 0.3: R16.2 C22.2 33.11,35.75 v32.86,35.99
  Top 0.305: U1.12 31.9,61.85 31.36,61.32 v31.36,60.81
  Bottom 0.3: v32.86,35.99 32.16,36.69 32.16,45.89 29.16,48.9 29.16,57.61 31.36,59.81 v31.36,60.81
SWITCH_5  (via drill 0.7 pad 1.5)
  Top 0.3: U1.26 52.69,60.58 53.32,61.21 54.18,61.21 v54.18,60.81 | C25.2 R19.2 33.06,50.79 v33.46,51.19
  Bottom 0.3: v33.46,51.19 33.46,51.59 34.96,53.09 53.06,53.09 54.76,54.79 54.76,60.23 v54.18,60.81
TW_AMP_MUTE
  Top 0.3: X4.2 12.98,41.84 T2.C
TW_AMP_SHUTDOWN
  Top 0.3: T4.C 12.9,31.84 X4.4
TX2  (via drill 0.7 pad 1.5)
  Top 0.3: U1.28 51.87,63.12 52.7,63.96 v52.7,65.06
  Bottom 0.3: v52.7,65.06 52.7,65.96 54.43,67.69 57.66,67.69 59.06,66.29 59.06,54.59 62.99,50.66 UART.4
VCC_DAC
  Top 0.3: C4.1 16.2,21.71 17.97,21.71 17.97,21.72 18.17,21.52 CR1.5 18.17,19.92 19.55,18.53 C3.1 19.55,15.82 C2.1 | C2.1 19.69,15.96 U2.9 | IC1.8 25.63,8.48 23.82,8.48 C20.1 23.17,9.12 C19.1 23.17,12.18 22.26,13.09 21.16,13.09 19.5,14.75 C2.1
VQ
  Top 0.3: U2.5 26.07,18.1 26.93,18.96 C1.1